# EAGLE design base-2u-motor-dimmer-driver (EAGLE 6.2)
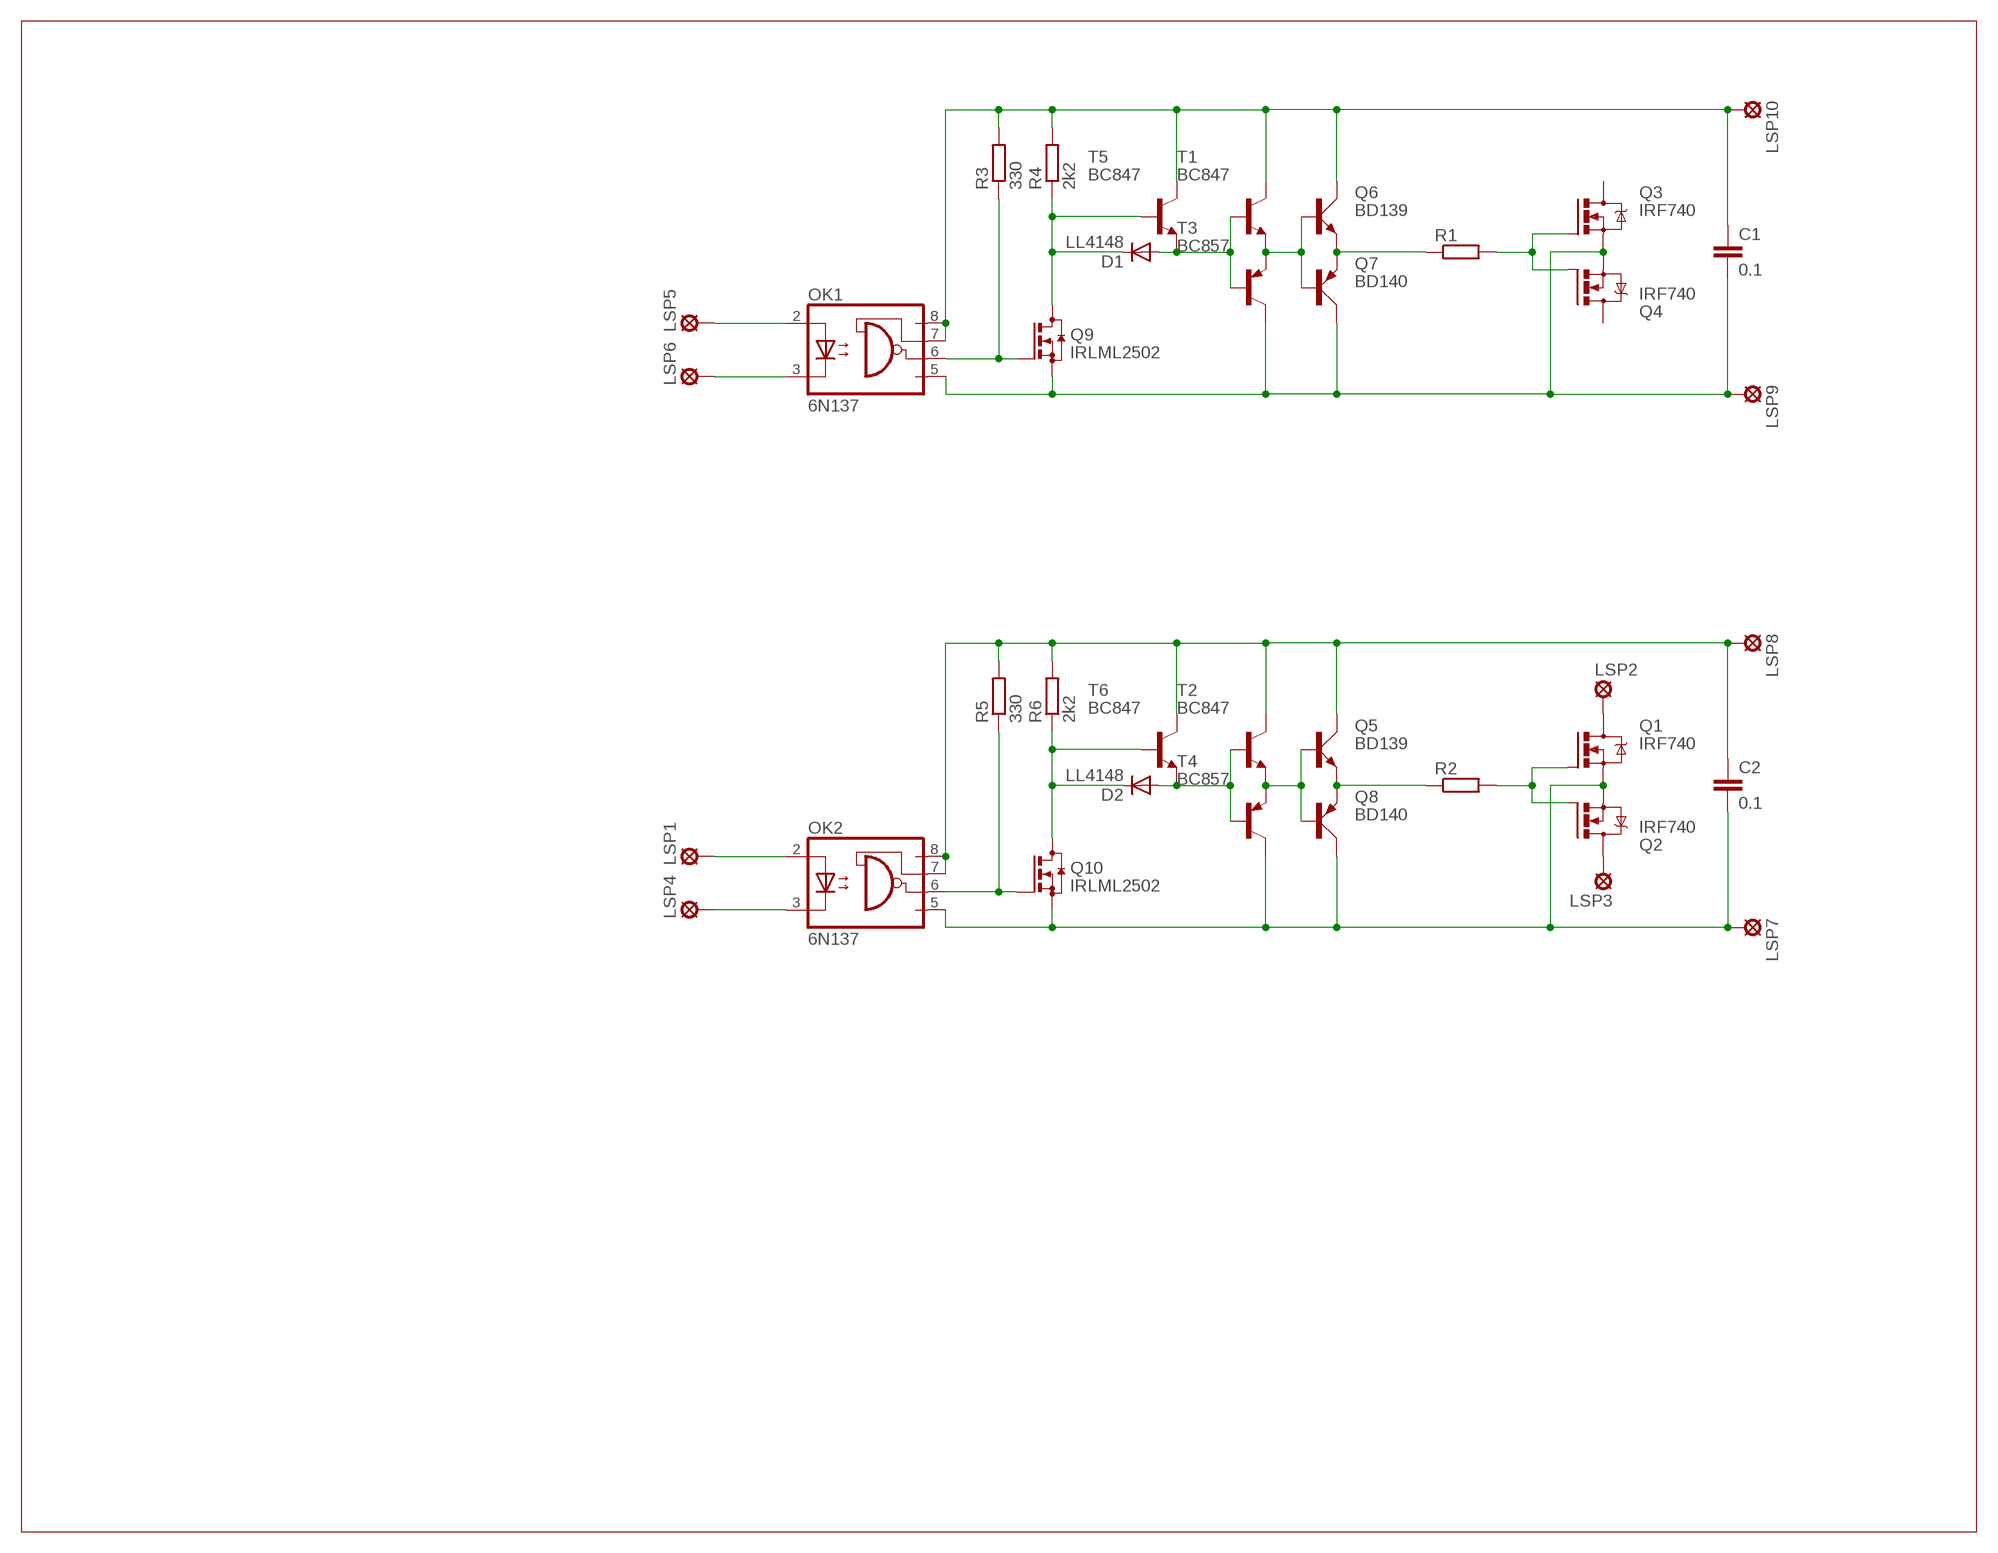
[diagram p0: schematic, sheet 1]

## Parts
C1  0.1  C-EUC1206  [C1206]
C2  0.1  C-EUC1206  [C1206]
D1  LL4148  DIODE-SOD80C  [SOD80C]
D2  LL4148  DIODE-SOD80C  [SOD80C]
LSP1  LSP10  [LSP10]
LSP2  LSP10  [LSP10]
LSP3  LSP10  [LSP10]
LSP4  LSP10  [LSP10]
LSP5  LSP10  [LSP10]
LSP6  LSP10  [LSP10]
LSP7  LSP10  [LSP10]
LSP8  LSP10  [LSP10]
LSP9  LSP10  [LSP10]
LSP10  LSP10  [LSP10]
OK1  6N137  [DIL08]
OK2  6N137  [DIL08]
Q1  IRF740  [TO220BV]
Q2  IRF740  [TO220BV]
Q3  IRF740  [TO220BV]
Q4  IRF740  [TO220BV]
Q5  BD139  [TO126AV]
Q6  BD139  [TO126AV]
Q7  BD140  [TO126AV]
Q8  BD140  [TO126AV]
Q9  IRLML2502  BSS123  [SOT23]
Q10  IRLML2502  BSS123  [SOT23]
R1  R-EU_R0805  [R0805]
R2  R-EU_R0805  [R0805]
R3  330  R-EU_R0805  [R0805]
R4  2k2  R-EU_R0805  [R0805]
R5  330  R-EU_R0805  [R0805]
R6  2k2  R-EU_R0805  [R0805]
T1  BC847  [SOT23]
T2  BC847  [SOT23]
T3  BC857  BC857B-PNP-SOT23-BEC  [SOT23-BEC]
T4  BC857  BC857B-PNP-SOT23-BEC  [SOT23-BEC]
T5  BC847  [SOT23]
T6  BC847  [SOT23]

## Nets
B_H: D1.A T1.1(B) T3.B T5.2(E)
B_L: D2.A T2.1(B) T4.B T6.2(E)
D_H: Q6.E Q7.E R1.1
D_L: Q5.E Q8.E R2.1
G_H: Q3.G Q4.G R1.2
G_L: Q1.G Q2.G R2.2
GND_H: C1.2 LSP9.MP OK1.5(GND) Q3.S Q4.S Q7.C Q9.2(S) T3.C
GND_L: C2.2 LSP7.MP OK2.5(GND) Q1.S Q2.S Q8.C Q10.2(S) T4.C
I_H: Q6.B Q7.B T1.2(E) T3.E
I_L: Q5.B Q8.B T2.2(E) T4.E
M_H: D1.C Q9.3(D) R4.1 T5.1(B)
M_L: D2.C Q10.3(D) R6.1 T6.1(B)
N$1: LSP5.MP OK1.2(A)
N$2: LSP6.MP OK1.3(C)
N$3: LSP4.MP OK2.3(C)
N$4: LSP2.MP Q1.D
N$5: LSP3.MP Q2.D
N$6: LSP1.MP OK2.2(A)
O_H: OK1.6(VO) Q9.1(G) R3.1
O_L: OK2.6(VO) Q10.1(G) R5.1
VCC1: C2.1 LSP8.MP OK2.7(VE) OK2.8(VCC) Q5.C R5.2 R6.2 T2.3(C) T6.3(C)
VCC_H: C1.1 LSP10.MP OK1.7(VE) OK1.8(VCC) Q6.C R3.2 R4.2 T1.3(C) T5.3(C)
Unconnected: Q3.D Q4.D

## Library data of the parts
C1 C2 = rcl:C-EU: CAPACITOR, European symbol
D1 D2 = diode:DIODE-: DIODE
LSP1-LSP10 = solpad:LSP10: SOLDER PAD drill 1.0 mm, distributor Buerklin, 12H555
OK1 OK2 = optocoupler:6N137: MOTOROLA OPTO COUPLER; MPN: 6N137; OC_FARNELL: 1328376; OC_NEWARK: 52M1895
Q1-Q4 = transistor-power:IRF740: N-CHANNEL MOS FET
Q5 Q6 = transistor-power:BD139: NPN TRANSISTOR
Q7 Q8 = transistor-power:BD140: PNP TRANSISTOR
Q9 Q10 = transistor-small-signal:BSS123: N-CHANNEL MOS FET
R1-R6 = rcl:R-EU_: RESISTOR, European symbol
T1 T2 T5 T6 = transistor:BC847: NPN TRANSISTOR
T3 T4 = transistor:*-PNP-: PNP Transistror

## Board
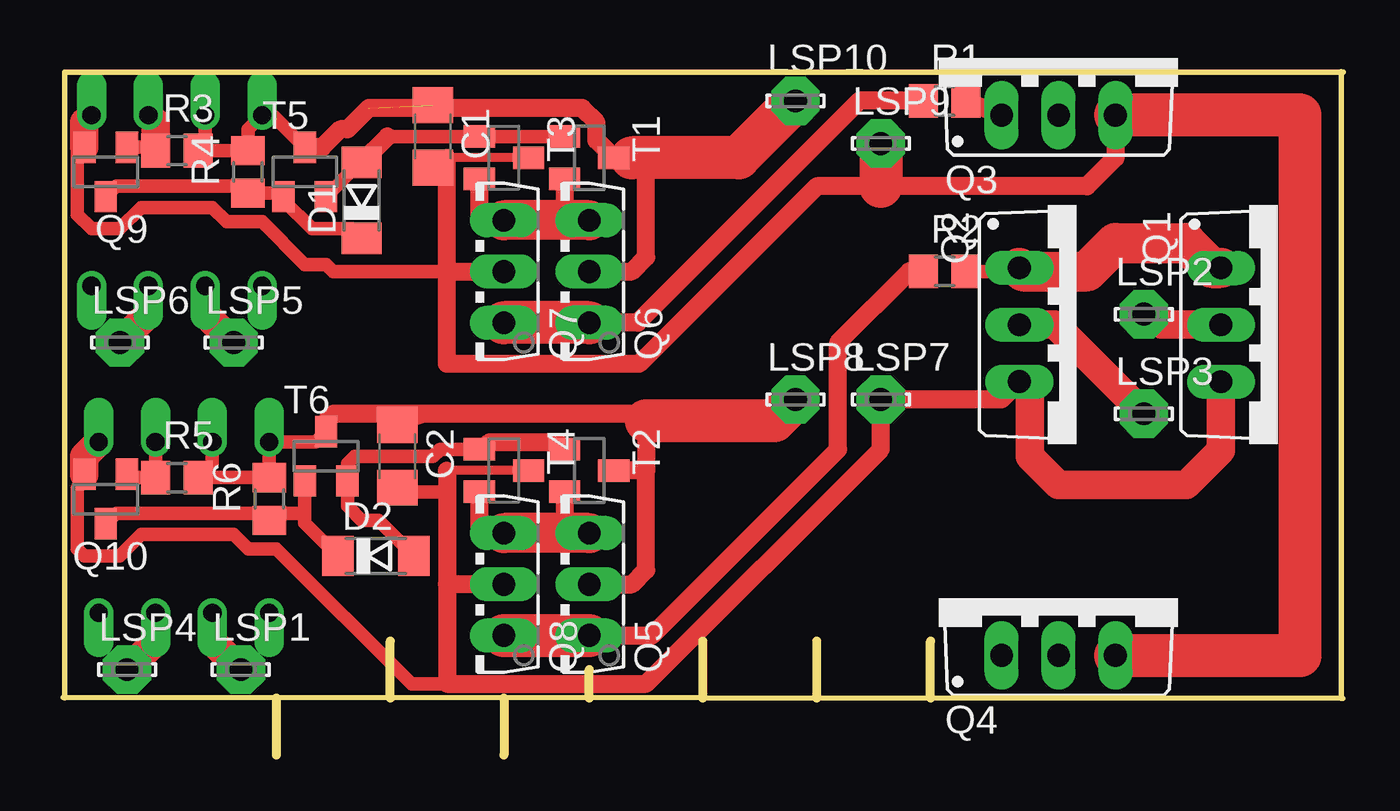
[diagram p1: board, top side]
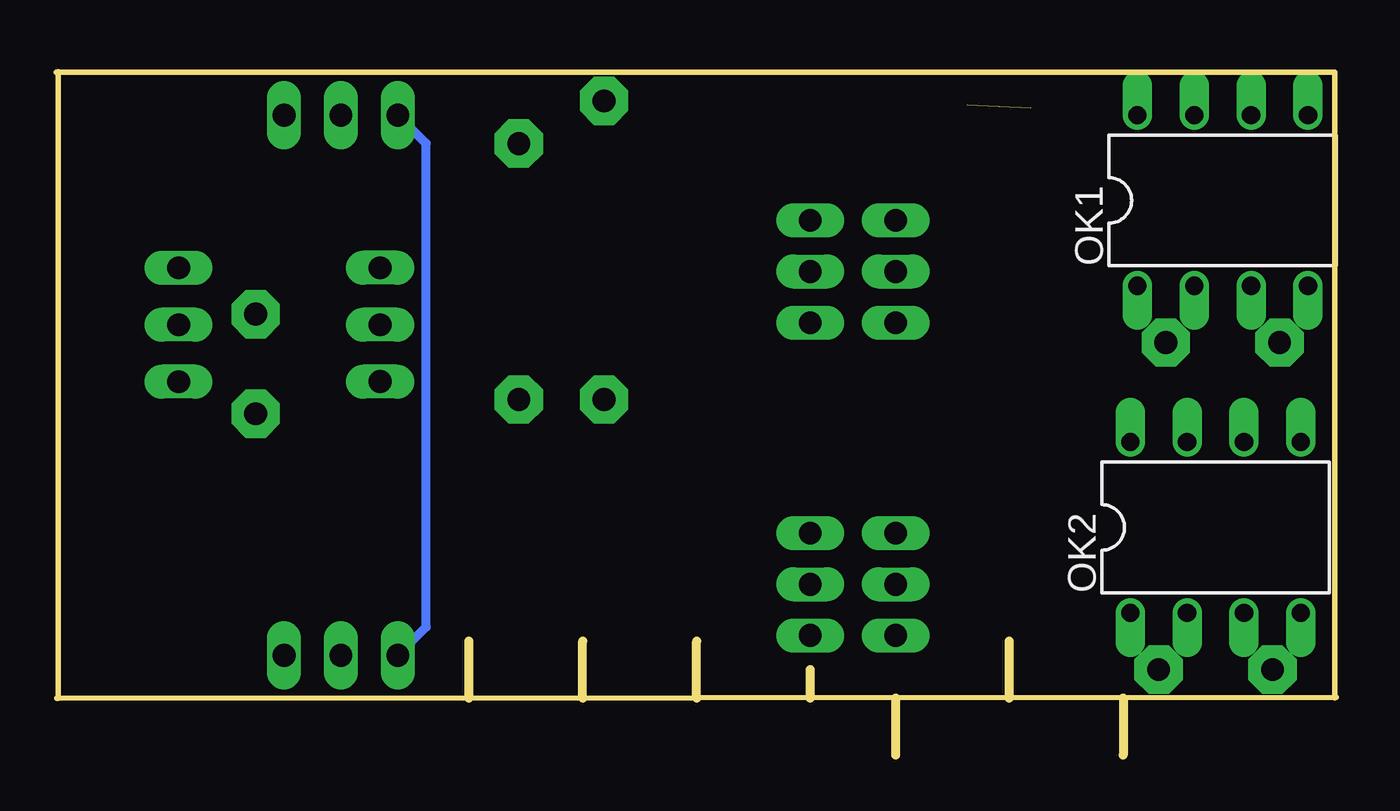
[diagram p2: board, bottom side, seen from below]

Size 57.16 x 30.5 mm. Coordinates in mm from the lower left corner, seen from the top.
Outline: 57.16,30.5 0.08,30.5 0.08,2.55
Outline: 0,2.56 57.15,2.52
Outline: 57.08,2.53 57.08,30.5
Outline: 38.73,2.54 38.73,5.08
Outline: 33.66,2.54 33.66,5.08
Outline: 28.58,2.54 28.58,5.08
Outline: 23.5,2.54 23.5,3.81
Outline: 19.69,2.54 19.69,0
Outline: 14.61,2.54 14.61,5.08
Outline: 9.53,2.54 9.53,0
Copper layers (1*16): Top 0.035mm / dielectric 1.5mm / Bottom 0.035mm
Design rules: minimum track width 10mil, minimum drill 24mil, track to track 8mil, track to pad 8mil, pad to pad 8mil, via to via 8mil, smd to smd 8mil, copper to edge 40mil, drill to drill 8mil, minimum pad ring 10mil, minimum via ring 8mil, stop-mask expansion 4mil, vias tented up to drill 0mil, thermal gap 10mil

### Footprints (pad centres in the part's own frame; a part is rotated, then mirrored left to right if it is on the bottom)
C1206 = smd 1.6 x 1.8: 1 -1.4,0; 2 1.4,0
SOD80C = smd 1.4 x 1.8: A 1.7,0; C -1.7,0
LSP10 = drill 1.016 pad 2.159 octagon: MP 0,0
DIL08 = drill 0.813 offset: 1 -3.81,-3.81; 2 -1.27,-3.81; 3 1.27,-3.81; 4 3.81,-3.81; 5 3.81,3.81; 6 1.27,3.81; 7 -1.27,3.81; 8 -3.81,3.81
TO220BV = drill 1.016 long: D 0,-2.54; G -2.54,-2.54; S 2.54,-2.54
TO126AV = drill 1.016 long: B 2.286,-1.27; C 0,-1.27; E -2.286,-1.27
SOT23 = smd 1 x 1.4: 1 -0.95,-1.1; 2 0.95,-1.1; 3 0,1.1
R0805 = smd 1.3 x 1.5: 1 -0.95,0; 2 0.95,0
SOT23-BEC = smd 1 x 1.4: B -0.95,-1.1; C 0,1.1; E 0.95,-1.1

### Placement (x,y rotation side)
C1  16.51,27.62 270 top
C2  14.92,13.33 270 top
D1  13.33,24.77 90 top
D2  13.97,8.89 0 top
LSP1  7.94,3.81 0 top
LSP2  48.26,19.68 0 top
LSP3  48.26,15.24 0 top
LSP4  2.86,3.81 0 top
LSP5  7.62,18.41 0 top
LSP6  2.54,18.41 0 top
LSP7  36.51,15.88 0 top
LSP8  32.7,15.88 0 top
LSP9  36.51,27.3 0 top
LSP10  32.7,29.21 0 top
OK1  5.08,24.77 0 bottom
OK2  5.4,10.16 0 bottom
Q1  54.24,19.21 270 top
Q2  45.24,19.21 270 top
Q3  44.45,31.11 0 top
Q4  44.45,6.98 0 top
Q5  22.23,7.62 90 top
Q6  22.23,21.59 90 top
Q7  18.41,21.59 90 top
Q8  18.41,7.62 90 top
Q9  1.91,26.04 180 top
Q10  1.91,11.43 180 top
R1  39.37,29.21 0 top
R2  39.37,21.59 0 top
R3  5.08,26.99 0 top
R4  8.26,26.04 90 top
R5  5.08,12.38 0 top
R6  9.21,11.43 90 top
T1  23.5,26.67 270 top
T2  23.5,12.7 270 top
T3  19.69,26.67 270 top
T4  19.69,12.7 270 top
T5  10.79,26.04 0 top
T6  11.75,13.33 0 top

### Tracks (layer width: path | path; a pad name or v marks a point on that pad's centre or on a via)
B_H
  Top 0.61: T5.2 13.28,26.46 D1.A | 14.49,27.62 T3.B T1.1
  Top 0.813: D1.A 14.49,27.62
B_L
  Top 0.61: T4.B 18.47,13.76 18.36,13.65 16.83,13.65 16.51,13.33 13.02,13.33 12.7,13.01 T6.2 12.7,11.12 13.33,10.48 14.08,10.48 D2.A
  Top 0.813: T4.B 18.73,13.65 19.05,13.97 22.08,13.97 T2.1
D_H
  Top 0.813: R1.1 35.56,29.21 25.65,19.3 Q6.E
  Top 1.93: Q6.E Q7.E
D_L
  Top 0.813: Q5.E 26.29,5.33 34.61,13.65 34.61,18.41 37.78,21.59 R2.1
  Top 1.93: Q8.E Q5.E
G_H
  Top 0.813: R1.2 Q3.G
  Bottom 0.406: Q4.G 40.64,5.71 40.64,27.3 Q3.G
G_L
  Top 0.61: Q2.G 42.54,21.59 R2.2
  Top 1.778: Q2.G 42.87,21.59 45.72,21.59 46.99,22.86 50.16,22.86 51.28,21.75 Q1.G
GND_H
  Top 0.406: T3.C 17.15,26.67
  Top 0.61: Q9.2 0.64,26.99 0.63,26.04 0.63,24.13 1.27,23.5 2.54,23.5 3.49,24.45 6.67,24.45 7.3,23.81 8.89,23.81 10.79,21.91 11.75,21.91 12.06,21.59 17.15,21.59 | C1.2 16.64,26.35 17.15,26.35
  Top 0.813: Q3.S 46.99,26.67 45.72,25.4 36.51,25.4 33.66,25.4 25.72,17.46 17.15,17.46 17.15,21.59 | 17.15,21.59 Q7.C | 17.15,21.59 17.15,26.35 17.15,26.67
  Top 1.27: OK1.5 0.96,28.26 Q9.2
  Top 1.93: Q4.S 55.25,4.45 55.25,28.57 Q3.S | LSP9.MP 36.51,25.4
GND_L
  Top 0.406: T4.C 17.15,12.7
  Top 0.61: Q10.2 0.63,11.89 0.63,9.21 0.95,8.89 2.54,8.89 3.49,9.84 7.62,9.84 8.26,9.21 9.53,9.21 15.56,3.17 17.15,3.17 | C2.2 15.11,11.75 17.15,11.75
  Top 0.813: 17.15,12.7 17.15,11.75 17.15,7.62 | Q8.C 17.15,7.62 | 17.15,7.62 17.15,3.17 26.04,3.17 36.51,13.65 LSP7.MP 41.9,15.88 Q2.S
  Top 1.27: Q1.S 51.7,13.6 50.16,12.06 44.45,12.06 43.18,13.33 43.18,16.2 Q2.S | OK2.5 0.96,13.34 Q10.2
I_H
  Top 0.813: T3.E 18.59,23.88 Q7.B | T1.2 22.4,23.88 Q6.B
  Top 1.778: Q6.B Q7.B
I_L
  Top 0.813: T4.E 18.59,9.91 Q8.B | T2.2 22.4,9.91 Q5.B
  Top 1.778: Q5.B Q8.B
M_H
  Top 0.61: R4.1 9.7,25.09 T5.1 9.85,24.76 11.11,23.5 12.9,23.5 D1.C | R4.1 8.11,24.93 | Q9.3 2.37,25.4 7.62,25.4 7.94,25.09 R4.1
M_L
  Top 0.61: Q10.3 2.37,10.79 8.57,10.79 8.89,10.48 R6.1 9.52,10.79 10.79,10.79 | 10.79,10.79 10.8,10.8 T6.1 | D2.C 10.79,10.37 10.79,10.79
N$1
  Top 1.27: OK1.2 6.35,19.68 LSP5.MP
N$2
  Top 1.27: OK1.3 3.81,19.68 LSP6.MP
N$3
  Top 1.27: OK2.3 4.13,5.08 LSP4.MP
N$4
  Top 1.27: Q1.D 49.05,19.21 LSP2.MP
N$5
  Top 1.27: Q2.D 44.29,19.21 LSP3.MP
N$6
  Top 1.27: OK2.2 6.67,5.08 LSP1.MP
O_H
  Top 0.61: R3.1 4.3,27.13 Q9.1
  Top 1.27: OK1.6 4.13,28.25 R3.1
O_L
  Top 0.61: Q10.1 3,12.38 R5.1 OK2.6
VCC1
  Top 0.61: OK2.7 6.67,13.02 R5.2 R6.2 OK2.8 11.28,13.97 T6.3 | C2.1 16.51,15.24
  Top 0.813: Q5.C 25.4,7.62 26.04,8.26 26.04,12.7 | 26.04,12.7 T2.3 | T6.3 11.75,14.92 12.06,15.24 16.51,15.24 26.04,15.24 26.04,14.92 26.04,12.7
  Top 1.93: LSP8.MP 31.75,14.92 26.04,14.92
VCC_H  (1 unrouted)
  Top 0.61: OK1.7 6.35,26.98 R3.2 7.94,26.99 R4.2 8.26,27.94 OK1.8 9.36,28.57 T5.3
  Top 0.813: Q6.C 25.4,21.59 26.04,22.22 26.04,26.67 25.4,26.67 T1.3 23.81,27.45 23.81,28.26 23.18,28.89 13.65,28.89 12.7,27.94 12.38,27.94 11.58,27.13 T5.3
  Top 1.93: LSP10.MP 30.16,26.67 25.4,26.67

### Text on the board
Measures: 24.74 | 15.24 | 5.74 | 15.89 | 40.64 | 65.39